# Altium schematic sheet CAN.SchDoc
size A3; SheetNumber: 8; SheetTotal: 9
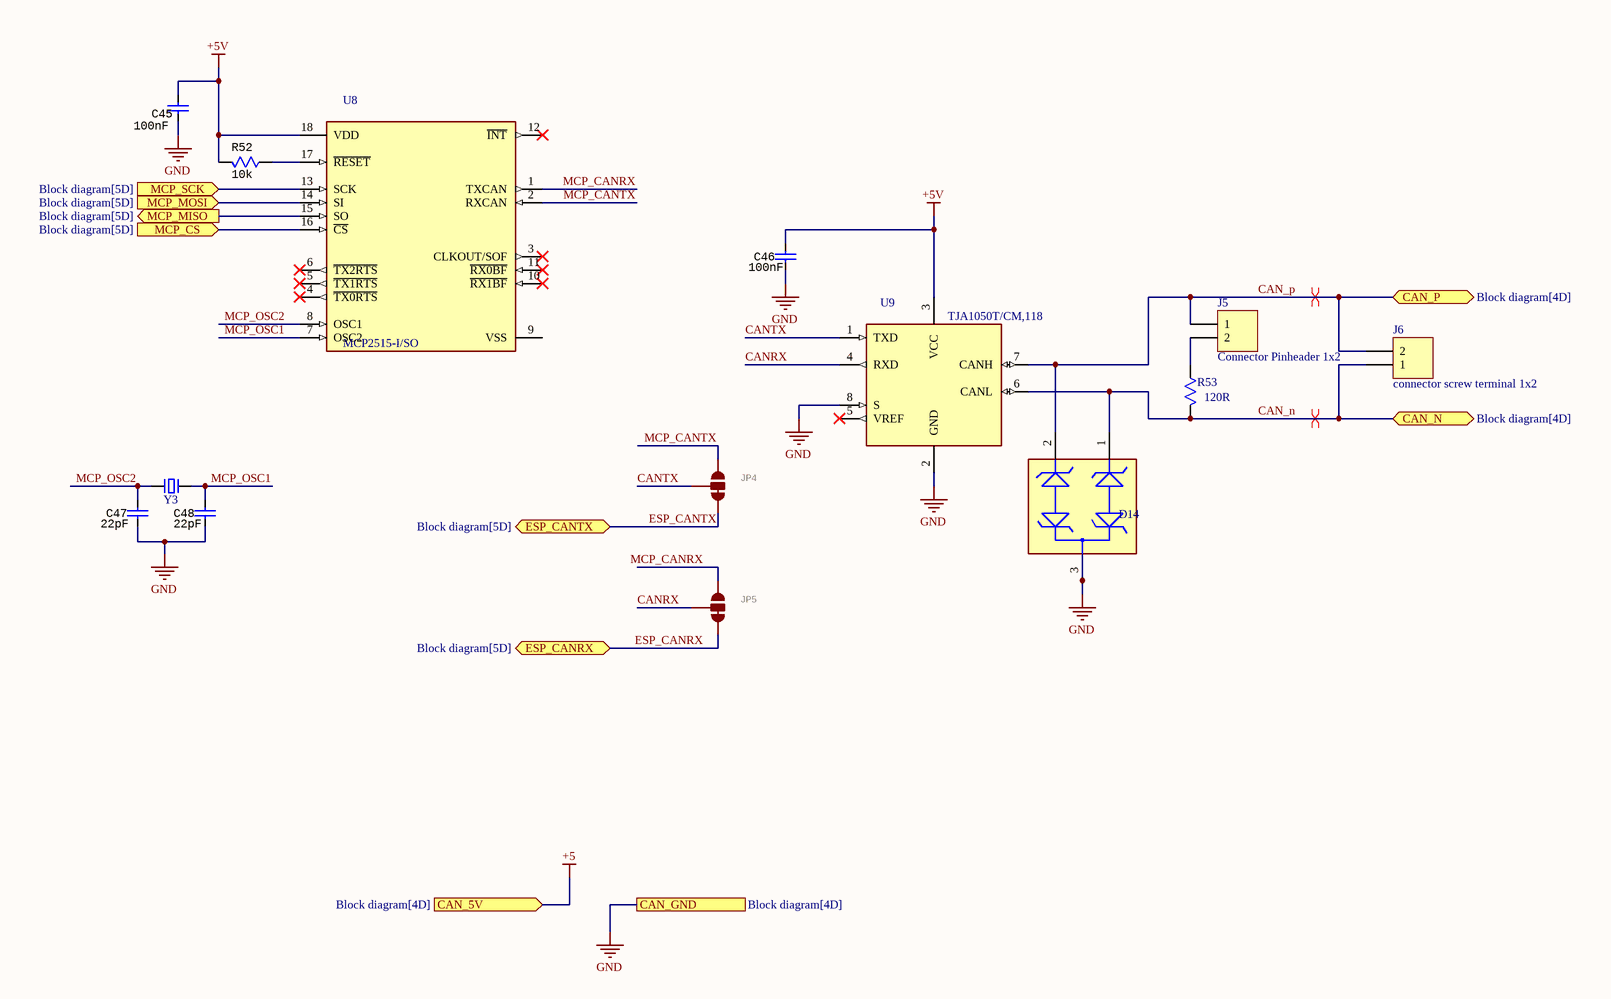
[diagram p0: CAN.SchDoc]

## Parts
C45  100nF  [CAP Ceramic SMD 0603]
C46  100nF  [CAP Ceramic SMD 0603]
C47  22pF  [CAP Ceramic SMD 0603]
C48  22pF  [CAP Ceramic SMD 0603]
D14  CPDT_12V  [SOT23]  (value not drawn)
J5  Connector Pinheader 1x2  [Header 1.27X2]
J6  connector screw terminal 1x2  [Connector screw terminal Block TH 1x2 3.5]
JP4  JUMPER-SMT_3_1-NC_TRACE_SILK  [SMT-JUMPER_3_1-NC_TRACE_SILK]  (value not drawn)
JP5  JUMPER-SMT_3_1-NC_TRACE_SILK  [SMT-JUMPER_3_1-NC_TRACE_SILK]  (value not drawn)
R52  value 10k  [RES SMD 0603]  (hidden comment: 10kR)
R53  120R  [RES SMD 0603]
U8  MCP2515-I/SO  [MCP2515]
U9  TJA1050T/CM,118  [TJA1050T/CM,118]
Y3  X49SD8MSD2SC  [Crystal TH 2-PIN HC-49S]  (value not drawn)

## Ports
CAN_5V (in, see Block diagram[4D]), CAN_GND (see Block diagram[4D]), CAN_N (bidir, see Block diagram[4D]), CAN_P (bidir, see Block diagram[4D]), ESP_CANRX (bidir, see Block diagram[5D]), ESP_CANTX (bidir, see Block diagram[5D]), MCP_CS (in, see Block diagram[5D]), MCP_MISO (out, see Block diagram[5D]), MCP_MOSI (in, see Block diagram[5D]), MCP_SCK (in, see Block diagram[5D])

## Nets
+5: port CAN_5V
+5V: C45.2 C46.2 R52.2 U8.18(VDD) U9.3(VCC)
GND: C45.1 C46.1 C47.1 C48.1 D14.3 U9.2(GND) U9.8(S) ; port CAN_GND
CAN_n: D14.1 J6.1 R53.2 U9.6(CANL) ; port CAN_N
CAN_p: D14.2 J5.1 J6.2 U9.7(CANH) ; port CAN_P
CANRX: JP5.2 U9.4(RXD)
CANTX: JP4.2 U9.1(TXD)
ESP_CANRX: JP5.3 ; port ESP_CANRX
ESP_CANTX: JP4.3 ; port ESP_CANTX
MCP_CANRX: JP5.1 U8.1(TXCAN)
MCP_CANTX: JP4.1 U8.2(RXCAN)
MCP_CS: U8.16(~{CS}) ; port MCP_CS
MCP_MISO: U8.15(SO) ; port MCP_MISO
MCP_MOSI: U8.14(SI) ; port MCP_MOSI
MCP_OSC1: C48.2 U8.7(OSC2) Y3.1
MCP_OSC2: C47.2 U8.8(OSC1) Y3.2
MCP_SCK: U8.13(SCK) ; port MCP_SCK
NetJ5_2: J5.2 R53.1
NetR52_1: R52.1 U8.17(~{RESET})

Not connected (* = marked no-connect by the designer): U8 3(CLKOUT/SOF)* 4(~{TX0RTS})* 5(~{TX1RTS})* 6(~{TX2RTS})* 9(VSS) 10(~{RX1BF})* 11(~{RX0BF})* 12(~{INT})*; U9 5(VREF)*

## Layout directives
differential pair: CAN_n, CAN_p

## Library data of the parts
C45 C46 = CAP 0603 100nF 50V: Multilayer Ceramic Capacitors MLCC Surface Mount 0603 0.1uF 50 Volts X7R 10%; Manufacturer: Murata; Manufacturer Part Number: GRM188R71H104KA93D; Voltage Rating (DC): 50V; Insulation Resistance: 10GR; Value: 100nF; Supplier 1: LCSC; RoHS: Yes; Category: Ceramic Capacitors; Stock 1: 3546650; Pricing 1: 50=0.00420, 500=0.00330, 1500=0.00290, 5000=0.00260, 25000=0.00250, 50000=0.00240 (USD); Mount: Surface Mount; Case/Package: 0603; Number of Pins: 2; Case Code (Imperial): 0603; Case Code (Metric): 1608; Dielectric Material: Ceramic; Material: Ceramic; Contact Plating: Tin,Matte; Min Operating Temperature: -55°C; Max Operating Temperature: 125°C; Capacitance: 100nF; Tolerance: 10%; Packaging: Tape and Reel; Dielectric: X7R; Termination: SMD/SMT; Package Quantity: 1; Voltage Rating: 50V; Length: 1.6mm; Width: 0.8mm; Height: 0.8mm; Depth: 0.8mm; Thickness: 0.035inch; Radiation Hardening: No; RoHS Compliant: Yes; REACH SVHC: No SVHC; Lead Free: Lead Free; ComponentLink1URL: https://datasheet.ciiva.com/19467/1857604-19467681.pdf?src-supplier=Jameco; ComponentLink1Description: https://datasheet.ciiva.com/19467/1857604-19467681.pdf?src-supplier=Jameco; ComponentLink2URL: https://datasheet.ciiva.com/11786/0900766b807a1cab-11786047.pdf?src-supplier=RSComponents; ComponentLink2Description: https://datasheet.ciiva.com/11786/0900766b807a1cab-11786047.pdf?src-supplier=RSComponents; ComponentLink3URL: https://datasheet.ciiva.com/29201/451744-da-01-en-vs-kondensator-0603-29201904.pdf?src-supplier=Conrad; ComponentLink3Description: https://datasheet.ciiva.com/29201/451744-da-01-en-vs-kondensator-0603-29201904.pdf?src-supplier=Conrad; ComponentLink4URL: https://datasheet.ciiva.com/7937/4360-7937659.pdf?src-supplier=Element14; ComponentLink4Description: https://datasheet.ciiva.com/7937/4360-7937659.pdf?src-supplier=Element14; ComponentLink5URL: https://datasheet.ciiva.com/14116/nmgrm-data-en-14116602.pdf?src-supplier=Distrelec; ComponentLink5Description: https://datasheet.ciiva.com/14116/nmgrm-data-en-14116602.pdf?src-supplier=Distrelec; ComponentLink6URL: https://datasheet.ciiva.com/48436/nmgrm-data-en-48436667.pdf?src-supplier=Distrelec; ComponentLink6Description: https://datasheet.ciiva.com/48436/nmgrm-data-en-48436667.pdf?src-supplier=Distrelec; ComponentLink7URL: https://datasheet.ciiva.com/28534/4360-28534245.pdf?src-supplier=Element14; ComponentLink7Description: https://datasheet.ciiva.com/28534/4360-28534245.pdf?src-supplier=Element14; ComponentLink8URL: https://datasheet.ciiva.com/131/partnumbering-e-01-131739.pdf?src-supplier=Digi-Key; ComponentLink8Description: https://datasheet.ciiva.com/131/partnumbering-e-01-131739.pdf?src-supplier=Digi-Key; ComponentLink9URL: https://datasheet.ciiva.com/131/partnumbering-e-01-131738.pdf?src-supplier=Digi-Key; ComponentLink9Description: https://datasheet.ciiva.com/131/partnumbering-e-01-131738.pdf?src-supplier=Digi-Key; ComponentLink10URL: https://datasheet.ciiva.com/131/partnumbering-e-01-131740.pdf?src-supplier=Digi-Key; ComponentLink10Description: https://datasheet.ciiva.com/131/partnumbering-e-01-131740.pdf?src-supplier=Digi-Key; ComponentLink11URL: https://datasheet.ciiva.com/7937/1747470-7937658.pdf?src-supplier=Element14; ComponentLink11Description: https://datasheet.ciiva.com/7937/1747470-7937658.pdf?src-supplier=Element14; Supplier Part Number 1: C77055; Voltage: 50V
C47 C48 = CAP 0603 22pF 50V: CAP CER 22PF 50V C0G/NP0 0603; Manufacturer: Samsung; Manufacturer Part Number: CL10C220JB81PNC; Tolerance: 5%; Dielectric: C0G; Temperature Coefficient: 300ppm/°C; Value: 22pF; Supplier 1: LCSC; RoHS: Yes; Category: Ceramic Capacitors; Stock 1: 8800; Pricing 1: 50=0.02060, 500=0.01690, 1500=0.01410, 5000=0.01190, 25000=0.01150, 50000=0.01130 (USD); Mount: Surface Mount; Case/Package: 0603; Case Code (Imperial): 0603; Case Code (Metric): 1608; Min Operating Temperature: -55°C; Max Operating Temperature: 125°C; Capacitance: 22pF; Packaging: Tape and Reel; Package Quantity: 1; Voltage Rating: 50V; Length: 1.6mm; Width: 0.031inch; Height: 0.8mm; Depth: 0.8mm; Thickness: 0.035inch; Radiation Hardening: No; RoHS Compliant: Yes; Lead Free: Lead Free; ComponentLink1URL: https://datasheet.ciiva.com/6293/tdkmlcccaprange-6293701.pdf?src-supplier=Digi-Key; ComponentLink1Description: https://datasheet.ciiva.com/6293/tdkmlcccaprange-6293701.pdf?src-supplier=Digi-Key; ComponentLink2URL: https://datasheet.ciiva.com/22694/1796654-22694102.pdf?src-supplier=Element14; ComponentLink2Description: https://datasheet.ciiva.com/22694/1796654-22694102.pdf?src-supplier=Element14; ComponentLink3URL: https://datasheet.ciiva.com/6293/tdkmlcccaprange-6293704.pdf?src-supplier=Digi-Key; ComponentLink3Description: https://datasheet.ciiva.com/6293/tdkmlcccaprange-6293704.pdf?src-supplier=Digi-Key; ComponentLink4URL: https://datasheet.ciiva.com/28576/1744655-28576921.pdf?src-supplier=Element14; ComponentLink4Description: https://datasheet.ciiva.com/28576/1744655-28576921.pdf?src-supplier=Element14; ComponentLink5URL: https://datasheet.ciiva.com/7975/1796654-7975034.pdf?src-supplier=Element14; ComponentLink5Description: https://datasheet.ciiva.com/7975/1796654-7975034.pdf?src-supplier=Element14; ComponentLink6URL: https://datasheet.ciiva.com/26946/getdatasheetpartid-741952-26946507.pdf?src-supplier=Verical; ComponentLink6Description: https://datasheet.ciiva.com/26946/getdatasheetpartid-741952-26946507.pdf?src-supplier=Verical; ComponentLink7URL: https://datasheet.ciiva.com/6293/tdkmlcccaprange-6293708.pdf?src-supplier=Digi-Key; ComponentLink7Description: https://datasheet.ciiva.com/6293/tdkmlcccaprange-6293708.pdf?src-supplier=Digi-Key; ComponentLink8URL: https://datasheet.ciiva.com/16395/cl10c220jb81pnc-16395896.pdf?src-supplier=Future+Electronics; ComponentLink8Description: https://datasheet.ciiva.com/16395/cl10c220jb81pnc-16395896.pdf?src-supplier=Future+Electronics; ComponentLink9URL: https://datasheet.ciiva.com/15195/getdatasheetpartid-500209-15195809.pdf?src-supplier=Verical; ComponentLink9Description: https://datasheet.ciiva.com/15195/getdatasheetpartid-500209-15195809.pdf?src-supplier=Verical; Supplier Part Number 1: C170132; Voltage: 50V; Series: CL; Ratings: AEC-Q200; Supplier 2: LCSC; Supplier Part Number 2: C1653
D14 = CPDT_12V: TVS DIODE SOT23-3 (CAN TVS); Manufacturer: Bourns Inc.; Manufacturer Part Number: CDSOT23-SM712; Package: SOT23; ComponentLink2URL: https://www.bourns.com/docs/Product-Datasheets/CDSOT23-SM712.pdf; ComponentLink2Description: Datasheet
J5 = Connector Pinheader 1x2: Header_2x1
J6 = connector screw terminal 1x2: 691214110002 - Wire-To-Board Terminal Block, 3.5 mm, 2 Positions, 24 AWG, 16 AWG, 1.5 mm², Screw; Manufacturer: Wurth Electronics; Plating: Brass,Steel; Number of Levels: 1; Number of Positions Per Level: 2; Current: 10A; Voltage: 300V; Wire Gauge (Max): 24AWG; Wire Gauge (Min): 16AWG; Pitch: 0.138inch; Stripping Length: -6mm; Supplier 1: Digi-Key; Manufacturer Part Number: 691214110002; RoHS: Yes; Category: Terminal Blocks; Stock 1: 5949; Pricing 1: 1=0.83000, 10=0.73900, 50=0.63800, 100=0.57100, 500=0.53800, 1400=0.50400 (USD); Mount: Through Hole; Color: Blue,Green; Housing Material: PA66; Contact Material: Brass; Contact Plating: Brass,Tin; Min Operating Temperature: -40°C; Max Operating Temperature: 105°C; Packaging: Bulk; Termination: Screw; Package Quantity: 1400; Number of Contacts: 2; Series: WR-TBL Series 2141; Voltage Rating: 300V; Current Rating: 10A; Length: 7.4mm; Width: 7.9mm; Height: 12.2mm; Wire/Cable Gauge: 24AWG; REACH SVHC: Unknown; RoHS Compliant: Yes; ComponentLink1URL: https://datasheet.ciiva.com/824/6912141100xx-824001.pdf?src-supplier=Digi-Key; ComponentLink1Description: https://datasheet.ciiva.com/824/6912141100xx-824001.pdf?src-supplier=Digi-Key; ComponentLink2URL: https://datasheet.ciiva.com/48693/001088618-da-01-en-wr-tbl-terminal-block2141-691214110002-48693195.pdf?src-supplier=Conrad; ComponentLink2Description: https://datasheet.ciiva.com/48693/001088618-da-01-en-wr-tbl-terminal-block2141-691214110002-48693195.pdf?src-supplier=Conrad; Supplier Part Number 1: 732-2747-ND
JP4 JP5 = JUMPER-SMT_3_1-NC_TRACE_SILK: Normally closed trace jumper (1 of 2 connections)    This jumper has a trace between two pads so it's normally closed (NC). The other connection is normally open (NO). Use a razor knife to open the connection. For best results follow the IPC guidelines for cutting traces: Cutout at least 0.063 mm (0.005 in).  Remove all loose material to clean up the cut area.  Seal the cut with an approved epoxy.       Reapply solder to reclose the connection, or to close the NO connection.; GateName_1: G$1; SymbolName_1: SMT-JUMPER_3_1-NC_TRACE; DeviceName: _SILK; LibraryName: SparkFun-Jumpers; DeviceSetName: JUMPER-SMT_3_1-NC_TRACE; Package: SMT-JUMPER_3_1-NC_TRACE_SILK
R52 = RES 0603 10k 1%: Res Thick Film 0603 10K Ohm 1% 1/10W ±100ppm/°C Molded SMD Punched Carrier T/R; Manufacturer: Panasonic; Manufacturer Part Number: ERJ-3EKF1002V; Max Power Dissipation: 100mW; Voltage Rating: 75V; Tolerance: 1%; Supplier 1: LCSC; RoHS: Yes; Category: Chip SMD Resistors; Stock 1: 555600; Pricing 1: 50=0.010200, 500=0.008400, 1500=0.007300, 5000=0.006100, 25000=0.005500, 50000=0.005400 (AUD); Mount: Surface Mount; Case/Package: 0603; Number of Pins: 2; Case Code (Metric): 1608; Case Code (Imperial): 0603; Contact Plating: Tin; Size Code: 0603; Min Operating Temperature: -55°C; Max Operating Temperature: 155°C; Resistance: 10kR; Packaging: Tape and Reel; Resistor Type: Thick Film; Temperature Coefficient: 100ppm/°C; Number of Terminations: 2; Series: ERJ; Construction: Rectangular; Power Rating: 100mW; Features: Automotive AEC-Q200; Voltage Rating (DC): 75V; Package Quantity: 1; Resistance Tolerance: 1%; Termination: SMD/SMT; Technology: THICK FILM; Length: 1.6mm; Width: 0.031inch; Height: 0.45mm; Depth: 0.8mm; Radiation Hardening: No; RoHS Compliant: Yes; Military Standard: Not; Lead Free: Lead Free; REACH SVHC: No SVHC; ComponentLink1URL: https://datasheet.ciiva.com/7830/aoa0000ce2-7830729.pdf?src-supplier=Element14; ComponentLink1Description: https://datasheet.ciiva.com/7830/aoa0000ce2-7830729.pdf?src-supplier=Element14; ComponentLink2URL: https://datasheet.ciiva.com/46372/1678782-46372725.pdf?src-supplier=Element14; ComponentLink2Description: https://datasheet.ciiva.com/46372/1678782-46372725.pdf?src-supplier=Element14; ComponentLink3URL: https://datasheet.ciiva.com/28514/426256-28514198.pdf?src-supplier=Element14; ComponentLink3Description: https://datasheet.ciiva.com/28514/426256-28514198.pdf?src-supplier=Element14; ComponentLink4URL: https://datasheet.ciiva.com/24070/aoa0000ce2-24070318.pdf?src-supplier=Mouser; ComponentLink4Description: https://datasheet.ciiva.com/24070/aoa0000ce2-24070318.pdf?src-supplier=Mouser; ComponentLink5URL: https://datasheet.ciiva.com/16759/70260748-16759807.pdf?src-supplier=Allied+Electronics; ComponentLink5Description: https://datasheet.ciiva.com/16759/70260748-16759807.pdf?src-supplier=Allied+Electronics; ComponentLink6URL: https://datasheet.ciiva.com/9194/aoa0000ce2-9194199.pdf?src-supplier=Avnet; ComponentLink6Description: https://datasheet.ciiva.com/9194/aoa0000ce2-9194199.pdf?src-supplier=Avnet; ComponentLink7URL: https://datasheet.ciiva.com/48530/aoa0000ce2-48530988.pdf?src-supplier=Avnet; ComponentLink7Description: https://datasheet.ciiva.com/48530/aoa0000ce2-48530988.pdf?src-supplier=Avnet; ComponentLink8URL: https://datasheet.ciiva.com/30208/aoa0000ce2-30208985.pdf?src-supplier=Onlinecomponents.com; ComponentLink8Description: https://datasheet.ciiva.com/30208/aoa0000ce2-30208985.pdf?src-supplier=Onlinecomponents.com; Supplier Part Number 1: C191124
R53 = RES 0603 120R 1%: Res General Purpose Thick Film 0603 120 Ohm 1% 1/10W ±100ppm/°C Molded SMD Paper T/R; Manufacturer 1: Yageo; Manufacturer Part Number 1: RC0603FR-07120RL; Max Power Dissipation: 100mW; Voltage Rating: 50V; Tolerance: 1%; Supplier 1: Digi-Key; RoHS: Yes; Category: Chip SMD Resistors; Stock 1: 1785774; Pricing 1: 1=0.10000, 10=0.02100, 100=0.00870, 1000=0.00390, 2500=0.00339 (USD); Case/Package: 0603; Number of Pins: 2; Case Code (Metric): 1608; Case Code (Imperial): 0603; Min Operating Temperature: -55°C; Max Operating Temperature: 155°C; Resistance: 120R; Packaging: Tape and Reel; Resistor Type: Thick Film; Number of Terminations: 2; Temperature Coefficient: 100ppm/°C; Features: Moisture Resistant; Package Quantity: 1; Power Rating: 100mW; Termination: SMD/SMT; Voltage Rating (DC): 50V; Length: 1.6mm; Width: 0.031inch; Height: 0.022inch; Depth: 0.8mm; RoHS Compliant: Yes; Military Standard: Not; Lead Free: Lead Free; REACH SVHC: No SVHC; ComponentLink1URL: https://datasheet.ciiva.com/46395/443971-46395021.pdf?src-supplier=Element14; ComponentLink1Description: https://datasheet.ciiva.com/46395/443971-46395021.pdf?src-supplier=Element14; Supplier Part Number 1: 311-120HRCT-ND; ComponentLink2Description: https://datasheet.ciiva.com/2553/pyu-r-int-thick-7-2553513.pdf?src-supplier=Digi-Key; ComponentLink2URL: https://datasheet.ciiva.com/2553/pyu-r-int-thick-7-2553513.pdf?src-supplier=Digi-Key; ComponentLink3Description: https://datasheet.ciiva.com/2553/pyu-r-int-thick-7-2553514.pdf?src-supplier=Digi-Key; ComponentLink3URL: https://datasheet.ciiva.com/2553/pyu-r-int-thick-7-2553514.pdf?src-supplier=Digi-Key; ComponentLink4Description: https://datasheet.ciiva.com/2553/pyu-r-int-thick-7-2553512.pdf?src-supplier=Digi-Key; ComponentLink4URL: https://datasheet.ciiva.com/2553/pyu-r-int-thick-7-2553512.pdf?src-supplier=Digi-Key; ComponentLink5Description: https://datasheet.ciiva.com/7746/443971-7746249.pdf?src-supplier=Element14; ComponentLink5URL: https://datasheet.ciiva.com/7746/443971-7746249.pdf?src-supplier=Element14; ComponentLink6Description: https://datasheet.ciiva.com/7746/443971-7746248.pdf?src-supplier=Element14; ComponentLink6URL: https://datasheet.ciiva.com/7746/443971-7746248.pdf?src-supplier=Element14; Construction: Rectangular; Resistance Tolerance: 1%; Series: RC; Size Code: 0603
U8 = MCP2515-I/SO: IC CAN CONTROLLER W/SPI 18SOIC; Manufacturer: Microchip; Min Supply Voltage: 2.7V; Max Supply Voltage: 5.5V; Standoff Height: 0.1mm; Nominal Supply Current: 10mA; Interface: SPI,CAN; Part Number: MCP2515-I/SO; Lead Free: Yes; RoHS: TRUE; ComponentLink2URL: http://ww1.microchip.com/downloads/en/DeviceDoc/MCP2515-Stand-Alone-CAN-Controller-with-SPI-20001801J.pdf; Package: C04-051; Function: Controller; Link: https://octopart.com/mcp2515-i%2Fso-microchip-430187; Temperature: -40°C to +85°C; Ipc Land Pattern Name: SOIC127P1030X265-18; Ambient Temperature Range Low: -65°C; Height: 2.65mm; Ambient Temperature Range High: +125°C; Temperature Range Low: -40°C; Temperature Range High: +85°C; ComponentLink2Description: Datasheet
U9 = TJA1050T/CM,118: 1/1 Transceiver Half CANbus 8-SO; Manufacturer: NXP USA; Part Number: TJA1050T/CM,118; Link: https://www.snapeda.com/parts/TJA1050T/CM,118/NXP%20USA%20Inc./view-part/304529/?ref=snap; Purchase-URL: https://pricing.snapeda.com/search/part/TJA1050T/CM,118/?ref=eda; Package: SO-8 NXP Semiconductors
Y3 = X49SD8MSD2SC: 8MHz 49S Crystals 20pF ±20ppm ±30ppm -20℃~+70℃ HC-49S Crystals ROHS; Part Number: *; Manufacturer: *; Supplier: *; Supplier Part Number: *; Value: *; Supplier 1: LCSC; Supplier Part Number 1: C21263; Manufacturer Part Number: X49SD8MSD2SC; RoHS: No; Stock 1: 118995; Pricing 1: 5=0.07050, 50=0.05680, 150=0.04990, 500=0.04480, 2500=0.04070, 5000=0.03870 (USD)